# Altium schematic sheet PMOD.SchDoc
size A4; DocumentNumber: 9; SheetNumber: 9; SheetTotal: 9; Project: Project name; Labo: LSN; PageSetup: Record=PageOptions|CenterHorizontal=True|CenterVertical=True|PrintScale=0.97|XCorrection=1.00|YCorrection=1.00|PrintKind=1|BorderSize=5000000|LeftOffset=0|BottomOffset=0|Orientation=2|PaperLength=1000|PaperWidth=1000|Scale=100|PaperSource=7|PrintQuality=-3|MediaType=1|DitherType=10|PrintScaleMode=1|PaperKind=A4 (210 x 297 mm)|PaperIndex=9
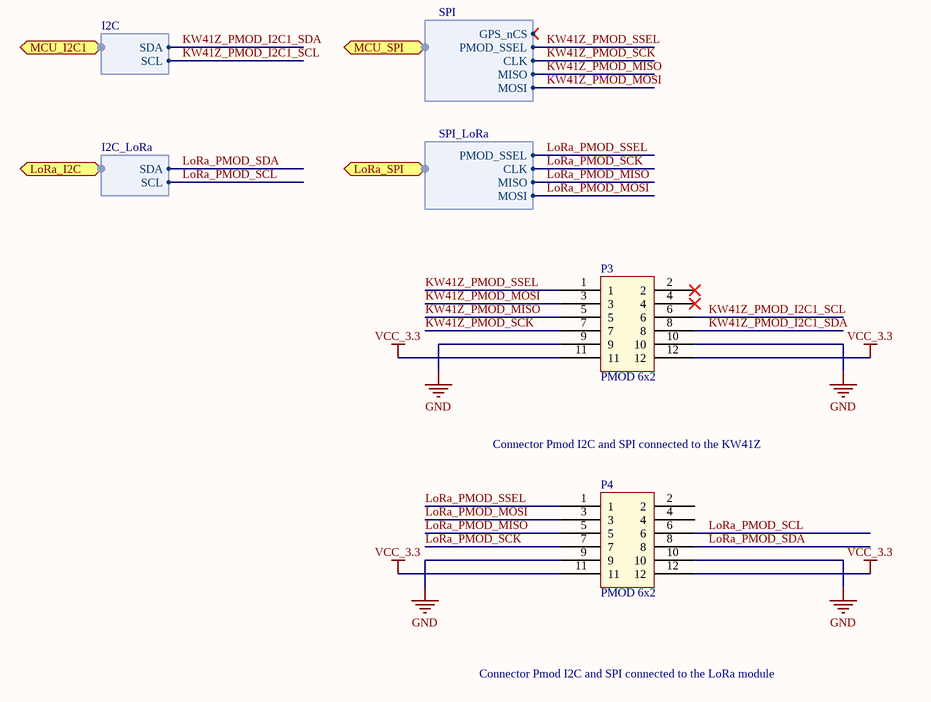
[diagram p0: PMOD.SchDoc]

## Parts
P3  PMOD 6x2  [PMOD SMD Header 6x2]
P4  PMOD 6x2  [PMOD SMD Header 6x2]

## Ports
LoRa_I2C (harness I2C_LoRa), LoRa_SPI (harness SPI_LoRa), MCU_I2C1 (harness I2C), MCU_SPI (harness SPI)

## Harnesses
I2C: SDA, SCL
SPI: PMOD_SSEL, CLK, MISO, MOSI, GPS_nCS
SPI_LoRa: PMOD_SSEL, CLK, MISO, MOSI
I2C_LoRa: SDA, SCL

## Nets
GND: P3.9 P3.10 P4.9 P4.10
VCC_3.3: P3.11 P3.12 P4.11 P4.12
KW41Z_PMOD_I2C1_SCL: P3.6 ; port MCU_I2C1.SCL
KW41Z_PMOD_I2C1_SDA: P3.8 ; port MCU_I2C1.SDA
KW41Z_PMOD_MISO: P3.5 ; port MCU_SPI.MISO
KW41Z_PMOD_MOSI: P3.3 ; port MCU_SPI.MOSI
KW41Z_PMOD_SCK: P3.7 ; port MCU_SPI.CLK
KW41Z_PMOD_SSEL: P3.1 ; port MCU_SPI.PMOD_SSEL
LoRa_PMOD_MISO: P4.5 ; port LoRa_SPI.MISO
LoRa_PMOD_MOSI: P4.3 ; port LoRa_SPI.MOSI
LoRa_PMOD_SCK: P4.7 ; port LoRa_SPI.CLK
LoRa_PMOD_SCL: P4.6 ; port LoRa_I2C.SCL
LoRa_PMOD_SDA: P4.8 ; port LoRa_I2C.SDA
LoRa_PMOD_SSEL: P4.1 ; port LoRa_SPI.PMOD_SSEL

Not connected (* = marked no-connect by the designer): P3 2* 4*; P4 2 4

## Notes on the sheet
- Connector Pmod I2C and SPI connected to the KW41Z
- Connector Pmod I2C and SPI connected to the LoRa module
- Title:
- Date:
- Project:
- Engineer:
- Revision:
- Sheet
- of
- Labo:
- File:

## Library data of the parts
P3 P4 = CMP-001-0115-A.1: Header, 6-Pin, Dual row